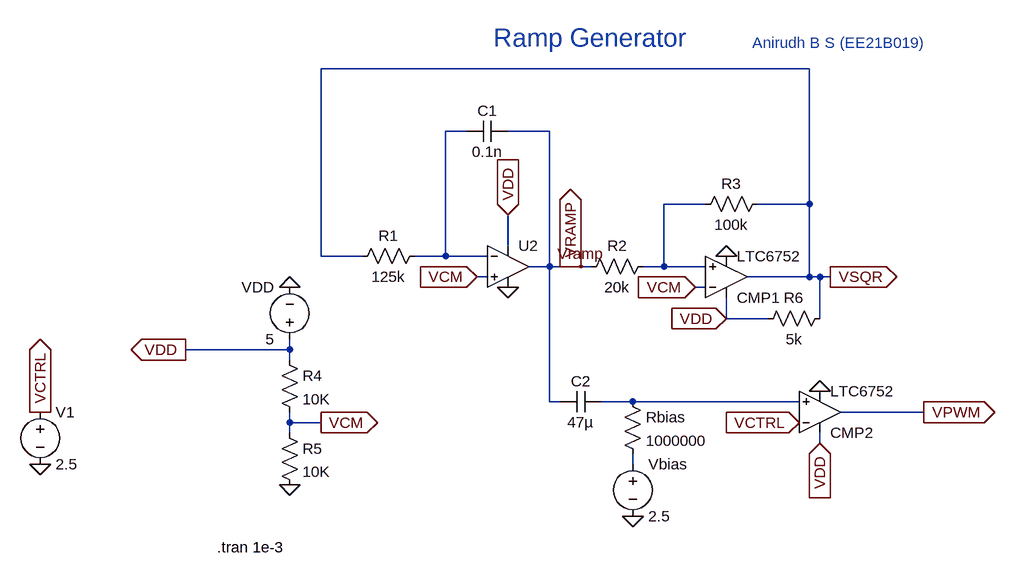
[diagram p0: schematic Experiment 1.asc]
Experiment 1.asc, the LTspice schematic file:
Version 4
SHEET 1 1476 680
WIRE 704 -192 -48 -192
WIRE 176 -96 144 -96
WIRE 304 -96 240 -96
WIRE 544 16 480 16
WIRE 704 16 704 -192
WIRE 704 16 624 16
WIRE 240 80 240 32
WIRE -48 96 -48 -192
WIRE 16 96 -48 96
WIRE 144 96 144 -96
WIRE 144 96 96 96
WIRE 208 96 144 96
WIRE 304 112 304 -96
WIRE 304 112 272 112
WIRE 336 112 304 112
WIRE 352 112 336 112
WIRE 368 112 352 112
WIRE 480 112 480 16
WIRE 480 112 448 112
WIRE 544 112 480 112
WIRE 208 128 192 128
WIRE 704 128 704 16
WIRE 704 128 608 128
WIRE 720 128 704 128
WIRE 736 128 720 128
WIRE 544 144 528 144
WIRE 576 192 576 160
WIRE 640 192 576 192
WIRE 720 192 720 128
WIRE -96 240 -96 224
WIRE -96 240 -256 240
WIRE -96 256 -96 240
WIRE 304 320 304 112
WIRE 320 320 304 320
WIRE 432 320 384 320
WIRE 688 320 432 320
WIRE 880 336 752 336
WIRE -96 352 -96 336
WIRE -48 352 -96 352
WIRE -96 368 -96 352
WIRE 720 384 720 368
WIRE 432 416 432 400
FLAG -96 448 0
FLAG -48 352 VCM
IOPIN -48 352 Out
FLAG -96 144 0
FLAG 192 128 VCM
IOPIN 192 128 In
FLAG 528 144 VCM
IOPIN 528 144 In
FLAG 240 144 0
FLAG 576 96 0
FLAG 720 304 0
FLAG 432 496 0
FLAG -256 240 VDD
IOPIN -256 240 Out
FLAG 240 32 VDD
IOPIN 240 32 In
FLAG 576 192 VDD
IOPIN 576 192 In
FLAG 720 384 VDD
IOPIN 720 384 In
FLAG 736 128 VSQR
IOPIN 736 128 Out
FLAG 880 336 VPWM
IOPIN 880 336 Out
FLAG 352 112 Vramp
FLAG -480 336 VCTRL
IOPIN -480 336 Out
FLAG 688 352 VCTRL
IOPIN 688 352 In
FLAG 336 112 VRAMP
IOPIN 336 112 Out
FLAG -480 416 0
SYMBOL res 112 80 R90
WINDOW 0 0 56 VBottom 2
WINDOW 3 32 56 VTop 2
SYMATTR InstName R1
SYMATTR Value 125k
SYMBOL cap 240 -112 R90
WINDOW 0 0 32 VBottom 2
WINDOW 3 32 32 VTop 2
SYMATTR InstName C1
SYMATTR Value 0.1n
SYMBOL cap 384 304 R90
WINDOW 0 0 32 VBottom 2
WINDOW 3 32 32 VTop 2
SYMATTR InstName C2
SYMATTR Value 47µ
SYMBOL res 416 304 R0
SYMATTR InstName Rbias
SYMATTR Value 1000000
SYMBOL res 464 96 R90
WINDOW 0 0 56 VBottom 2
WINDOW 3 32 56 VTop 2
SYMATTR InstName R2
SYMATTR Value 20k
SYMBOL Comparators\\LTC6752 576 192 M180
SYMATTR InstName CMP1
SYMBOL Comparators\\LTC6752 720 400 M180
SYMATTR InstName CMP2
SYMBOL res 640 0 R90
WINDOW 0 0 56 VBottom 2
WINDOW 3 32 56 VTop 2
SYMATTR InstName R3
SYMATTR Value 100k
SYMBOL res -112 352 R0
SYMATTR InstName R5
SYMATTR Value 10K
SYMBOL res -112 240 R0
SYMATTR InstName R4
SYMATTR Value 10K
SYMBOL voltage -96 240 R180
WINDOW 0 24 96 Left 2
WINDOW 3 24 16 Left 2
WINDOW 123 0 0 Left 0
WINDOW 39 0 0 Left 0
SYMATTR InstName VDD
SYMATTR Value 5
SYMBOL voltage 432 400 R0
WINDOW 123 0 0 Left 0
WINDOW 39 0 0 Left 0
SYMATTR InstName Vbias
SYMATTR Value 2.5
SYMBOL res 736 176 R90
WINDOW 0 0 56 VBottom 2
WINDOW 3 32 56 VTop 2
SYMATTR InstName R6
SYMATTR Value 5k
SYMBOL voltage -480 320 R0
WINDOW 123 0 0 Left 0
WINDOW 39 0 0 Left 0
SYMATTR InstName V1
SYMATTR Value 2.5
SYMBOL OpAmps\\UniversalOpAmp 240 112 R0
SYMATTR InstName U2
TEXT -208 544 Left 2 !.tran 1e-3
TEXT 368 -240 Center 4 ;Ramp Generator
TEXT 616 -232 Left 2 ;Anirudh B S (EE21B019)

The netlist it stands for:
* Experiment 1.asc
R1 N001 VSQR 125k
C1 Vramp N001 0.1n
C2 N003 Vramp 47µ
Rbias N003 N004 1000000
R2 N002 Vramp 20k
XCMP1 N002 VCM VDD 0 VSQR LTC6752  ; pins In+ In- V+ V- OUT
XCMP2 N003 VCTRL VDD 0 VPWM LTC6752  ; pins In+ In- V+ V- OUT
R3 VSQR N002 100k
R5 VCM 0 10K
R4 VDD VCM 10K
VDD VDD 0 5
Vbias N004 0 2.5
R6 VSQR VDD 5k
V1 VCTRL 0 2.5
XU2 VCM N001 VDD 0 Vramp level1 Avol=1Meg GBW=10Meg Vos=0 En=0 Enk=0 In=0 Ink=0 Rin=500Meg  ; pins In+ In- V+ V- OUT
.tran 1e-3
* Ramp Generator
* Anirudh B S (EE21B019)
.lib LTC7.lib
.lib UniversalOpAmp1.lib
.backanno
.end